# EAGLE schematic attiny85_arduino_as_ISP_programmer (EAGLE 7.7.0)
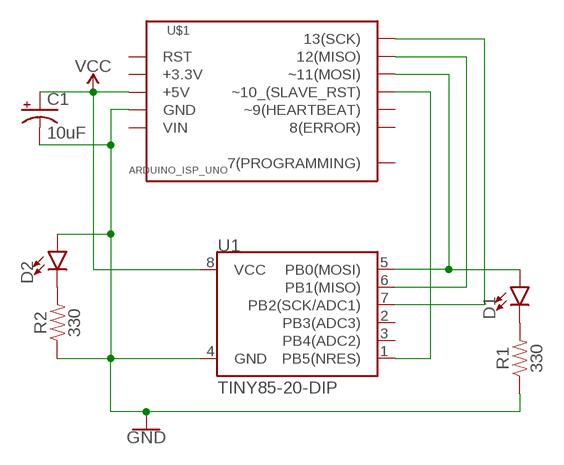
[diagram p0: schematic, sheet 1]

## Parts
C1  10uF  10UF-POLAR-RADIAL-2.5MM-25V-20%  [CPOL-RADIAL-2.5MM-5MM]
D1  LED3MM  [LED_3MM]
D2  LED3MM  [LED_3MM]
R1  330  330OHM-HORIZ-1/10W-5%  [AXIAL-0.3]
R2  330  330OHM-HORIZ-1/10W-5%  [AXIAL-0.3]
U1  TINY85-20-DIP  ATTINY45TINY85-20-DIP  [DIP08_MCU]
U$1  ARDUINO_ISP_UNO  [ARDUINO_UNO_ISP]

## Nets
GND: C1.2(-) D2.A R1.P$1 R2.P$1 U1.4(GND) U$1.GND@1(GND) U$1.GND@2(GND)
N$1: D1.K(C) R1.P$2
N$2: D2.K(C) R2.P$2
N$5: U1.7(PB2(SCK/ADC1)) U$1.D13(13(SCK))
N$6: U1.6(PB1(MISO)) U$1.D12(12(MISO))
N$7: D1.A U1.5(PB0(MOSI)) U$1.D11(~11(MOSI))
N$8: U1.1(PB5(NRES)) U$1.D10(~10_(SLAVE_RST))
VCC: C1.1(+) U1.8(VCC) U$1.5V(+5V)
Unconnected: U1.2(PB3(ADC3)) U1.3(PB4(ADC2)) U$1.3.3V(+3.3V) U$1.D7(7(PROGRAMMING)) U$1.D8(8(ERROR)) U$1.D9(~9(HEARTBEAT)) U$1.RST U$1.VIN

## Library data of the parts
C1 = SparkFun-Capacitors:10UF-POLAR: 10.0µF polarized capacitors A capacitor is a passive two-terminal electrical component used to store electrical energy temporarily in an electric field.; PROD_ID: CAP-08440
D1 D2 = SparkFun-LED:LED: LED (Generic) Standard schematic elements and footprints for 5mm, 3mm, 1206, and 0603 sized LEDs. Generic LEDs with no color specified.; PROD_ID: DIO-08794
R1 R2 = SparkFun-Resistors:330OHM: 330Ω resistor A resistor is a passive two-terminal electrical component that implements electrical resistance as a circuit element. Resistors act to reduce current flow, and, at the same time, act to lower voltage levels within circuits. - Wikipedia; PROD_ID: RES-8371
U1 = SparkFun-Retired:ATTINY45: Atmel 8-pin 2/4/8kB flash uC Retired; PROD_ID: IC-09445
U$1 = LuisLab-Boards:ARDUINO_ISP